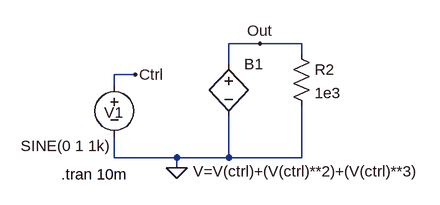
[diagram p0: schematic Bpoly.asc]
Bpoly.asc, the LTspice schematic file:
Version 4
SHEET 1 880 680
WIRE -128 224 -128 208
WIRE -128 336 -128 304
WIRE -96 208 -128 208
WIRE -32 336 -128 336
WIRE -32 352 -32 336
WIRE 48 192 48 160
WIRE 48 336 -32 336
WIRE 48 336 48 272
WIRE 96 160 48 160
WIRE 160 160 96 160
WIRE 160 176 160 160
WIRE 160 336 48 336
WIRE 160 336 160 256
FLAG -32 352 0
FLAG -96 208 Ctrl
FLAG 96 160 Out
SYMBOL voltage -128 208 R0
WINDOW 0 -16 58 Left 0
WINDOW 3 -144 110 Left 0
SYMATTR InstName V1
SYMATTR Value SINE(0 1 1k)
SYMATTR SpiceLine Rser=1
SYMBOL res 144 160 R0
SYMATTR InstName R2
SYMATTR Value 1e3
SYMBOL bv 48 176 R0
WINDOW 3 -55 181 Left 0
SYMATTR InstName B1
SYMATTR Value V=V(ctrl)+(V(ctrl)**2)+(V(ctrl)**3)
TEXT -210 362 Left 0 !.tran 10m

The netlist it stands for:
* Bpoly.asc
V1 Ctrl 0 SINE(0 1 1k) Rser=1
R2 Out 0 1e3
B1 Out 0 V=V(ctrl)+(V(ctrl)**2)+(V(ctrl)**3)
.tran 10m
.backanno
.end